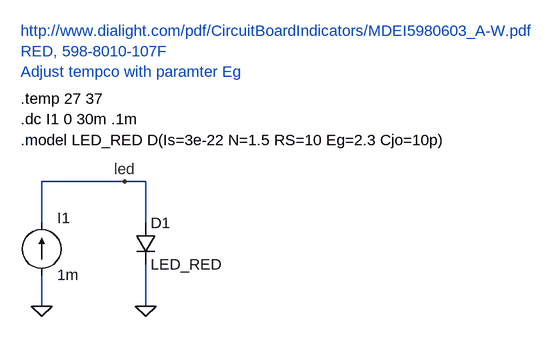
[diagram p0: schematic RED_Led_dialight_model.asc]
RED_Led_dialight_model.asc, the LTspice schematic file:
Version 4
SHEET 1 880 680
WIRE 32 80 -96 80
WIRE 64 80 32 80
WIRE -96 144 -96 80
WIRE 64 144 64 80
WIRE -96 272 -96 224
WIRE 64 272 64 208
FLAG 64 272 0
FLAG -96 272 0
FLAG 32 80 led
SYMBOL diode 48 144 R0
SYMATTR InstName D1
SYMATTR Value LED_RED
SYMBOL current -96 224 M180
WINDOW 0 24 88 Left 0
WINDOW 3 24 0 Left 0
SYMATTR InstName I1
SYMATTR Value 1m
TEXT -128 16 Left 0 !.model LED_RED D(Is=3e-22 N=1.5 RS=10 Eg=2.3 Cjo=10p)
TEXT -128 -16 Left 0 !.dc I1 0 30m .1m
TEXT -128 -152 Left 0 ;http://www.dialight.com/pdf/CircuitBoardIndicators/MDEI5980603_A-W.pdf\nRED, 598-8010-107F\nAdjust tempco with paramter Eg
TEXT -128 -48 Left 0 !.temp 27 37

The netlist it stands for:
* RED_Led_dialight_model.asc
D1 led 0 LED_RED
I1 0 led 1m
.model D D
.lib standard.dio
.model LED_RED D(Is=3e-22 N=1.5 RS=10 Eg=2.3 Cjo=10p)
.dc I1 0 30m .1m
* http://www.dialight.com/pdf/CircuitBoardIndicators/MDEI5980603_A-W.pdf
* RED, 598-8010-107F
* Adjust tempco with paramter Eg
.temp 27 37
.backanno
.end